# EasyEDA Pro project ProPrj_wildCat_2025-03-20.epro

# Schematic Schematic1
Board Name: Board1; Create Date: 2025-03-20; Page Name: P1; Project Name: wildCat; Schematic Name: Schematic1; Update Date: 2025-03-20; Company: 嘉立创EDA; Page Size: A4; Version: V1.0
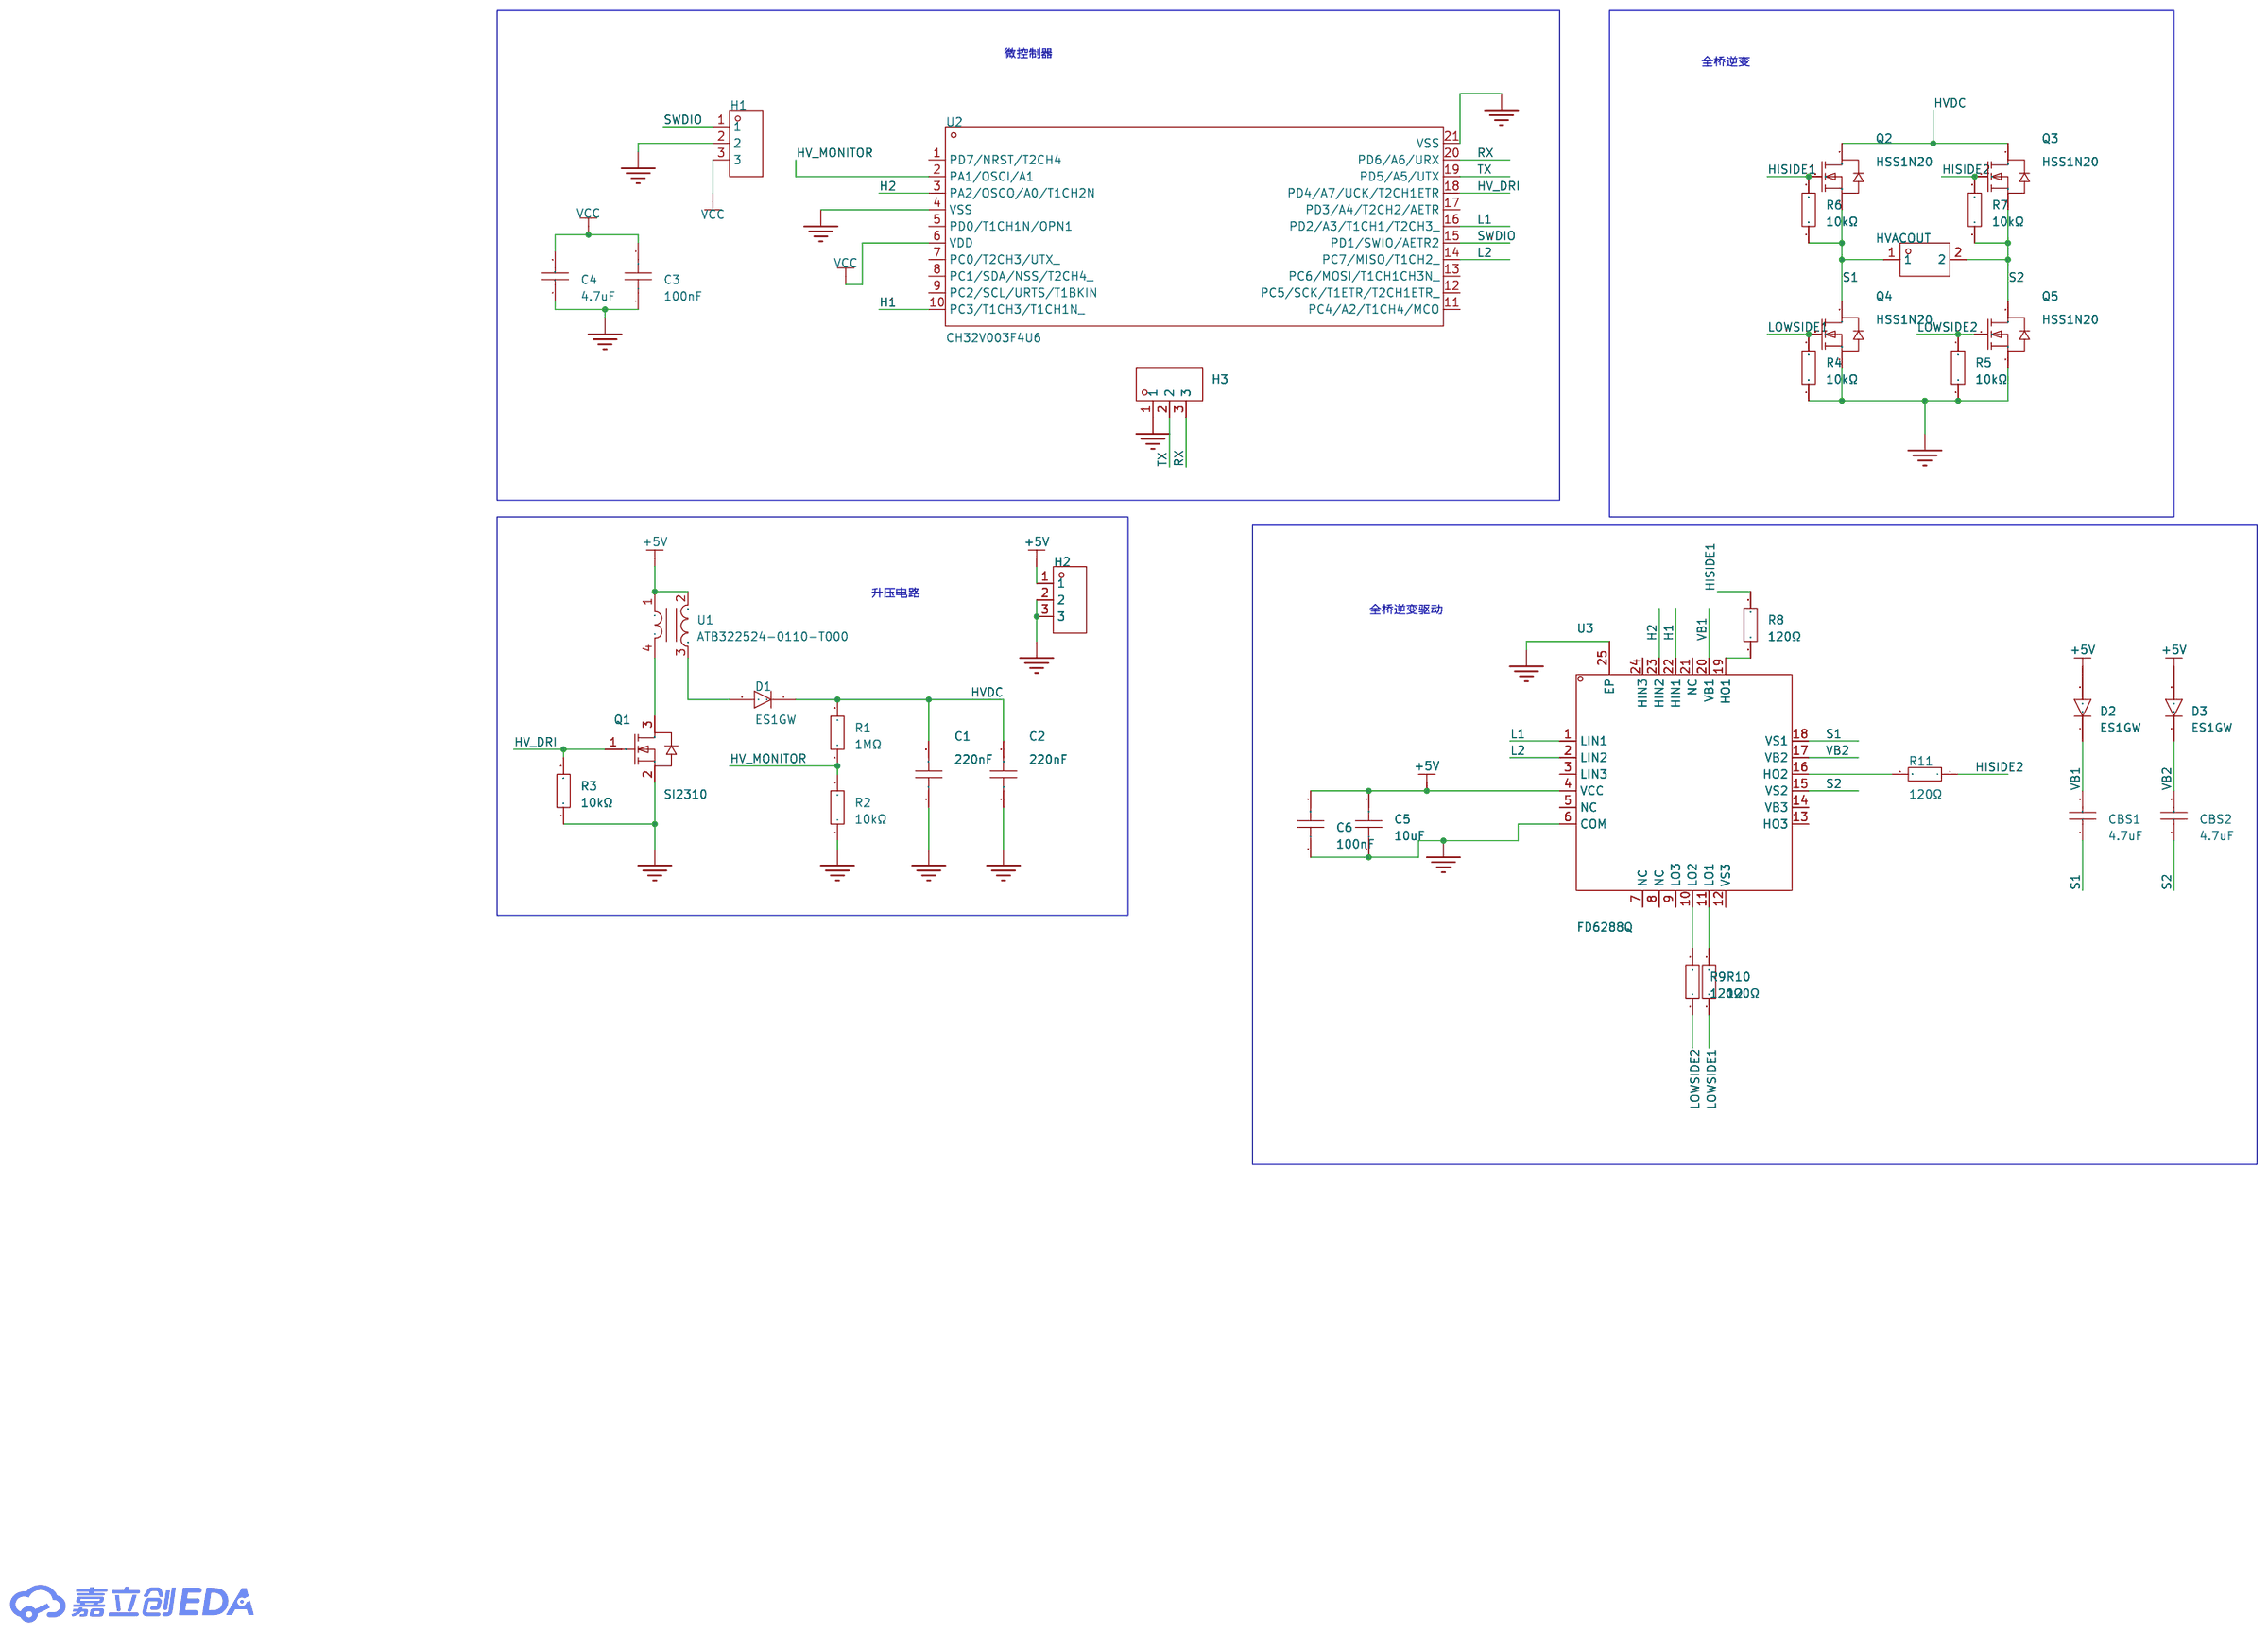
[diagram p0: schematic sheet]

## Parts
C1  220nF  [C1210]
C2  220nF  [C1210]
C3  100nF  [C0603]
C4  4.7uF  [C0805]
C5  10uF  [C1206]
C6  100nF  [C0603]
CBS1  4.7uF  [C0805]
CBS2  4.7uF  [C0805]
D1  ES1GW  [SOD-123FL_L2.7-W1.8-LS3.8-RD]
D2  ES1GW  [SOD-123FL_L2.7-W1.8-LS3.8-RD]
D3  ES1GW  [SOD-123FL_L2.7-W1.8-LS3.8-RD]
H1  -  [HDR-TH_3P-P2.54-V-F]
H2  -  [HDR-TH_3P-P2.54-V-F]
H3  -  [HDR-TH_3P-P2.54-V-F]
HVACOUT  -  [HDR-TH_2P-P2.54-V-M-2]
Q1  SI2310  [SOT-23_L2.9-W1.3-P1.90-LS2.4-BR]
Q2  HSS1N20  [SOT-23-3_L2.9-W1.6-P1.90-LS2.8-BR]
Q3  HSS1N20  [SOT-23-3_L2.9-W1.6-P1.90-LS2.8-BR]
Q4  HSS1N20  [SOT-23-3_L2.9-W1.6-P1.90-LS2.8-BR]
Q5  HSS1N20  [SOT-23-3_L2.9-W1.6-P1.90-LS2.8-BR]
R1  1MΩ  [R0603]
R2  10kΩ  [R0603]
R3  10kΩ  [R0603]
R4  10kΩ  [R0603]
R5  10kΩ  [R0603]
R6  10kΩ  [R0603]
R7  10kΩ  [R0603]
R8  120Ω  [R0603]
R9  120Ω  [R0603]
R10  120Ω  [R0603]
R11  120Ω  [R0603]
U1  ATB322524-0110-T000  [XFMR-SMD_ATB322515-0110-T000]
U2  CH32V003F4U6  [QFN-20_L3.0-W3.0-P0.40-TL-EP1.7]
U3  FD6288Q  [QFN-24_L4.0-W4.0-P0.50-BL-EP2.6]

## Library data of the parts
C1 C2 = CC1210KKX7RYBB224: 容值:220nF;精度:±10%;额定电压:250V;材质(温度系数):X7R;; LCSC Part Name: 220nF ±10% 250V; Supplier Part: C326671; Manufacturer: YAGEO(国巨); Supplier Footprint: 1210; JLCPCB Part Class: 扩展库; Datasheet: https://atta.szlcsc.com/upload/public/pdf/source/20181031/C326671_E05A76D6DA213ECA4F67921FD917BD9F.pdf; Supplier: LCSC; Tolerance: ±10%; Voltage Rated: 250V; Temperature Coefficient: X7R
C3 C6 = CGA0603X7R104K500JT: 容值:100nF;精度:±10%;额定电压:50V;温度系数:X7R;; LCSC Part Name: 100nF ±10% 50V; Supplier Part: C6119867; Manufacturer: HRE(芯声); Supplier Footprint: 0603; JLCPCB Part Class: 扩展库; Datasheet: https://atta.szlcsc.com/upload/public/pdf/source/20250103/C44077DA9E7B3EFAE02F22B6D3D1CBC9.pdf; Supplier: LCSC; Tolerance: ±10%; Voltage Rating: 50V; Temperature Coefficient: X7R
C4 CBS1 CBS2 = CL21A475KBQNNNE: 容值:4.7uF;精度:±10%;额定电压:50V;材质(温度系数):X5R;; LCSC Part Name: 4.7uF ±10% 50V; Supplier Part: C98192; Manufacturer: SAMSUNG(三星); Supplier Footprint: 0805; JLCPCB Part Class: 扩展库; Datasheet: https://atta.szlcsc.com/upload/public/pdf/source/20160218/1457707763339.pdf; Supplier: LCSC; Tolerance: ±10%; Voltage Rated: 50V; Temperature Coefficient: X5R
C5 = HGC1206R5106K500NSPJ: 容值:10uF;精度:±10%;额定电压:50V;温度系数:X5R;; LCSC Part Name: 10uF ±10% 50V; Supplier Part: C7432781; Manufacturer: Chinocera(华瓷); Supplier Footprint: 1206; JLCPCB Part Class: 扩展库; Datasheet: https://atta.szlcsc.com/upload/public/pdf/source/20240320/FAC3FEC40A78BC5CCCE96C232A94D860.pdf; Supplier: LCSC; Tolerance: ±10%; Voltage Rating: 50V; Temperature Coefficient: X5R
D1-D3 = ES1GW_C128697: 二极管配置:独立式;正向压降(Vf):1.25V@1A;直流反向耐压(Vr):400V;整流电流:1A;反向恢复时间(trr):35ns;; Supplier Part: C128697; Manufacturer: 晶导微电子; Supplier Footprint: SOD-123F; JLCPCB Part Class: 扩展库; Datasheet: https://atta.szlcsc.com/upload/public/pdf/source/20170918/C128697_1505700123436974922.pdf; Supplier: LCSC; Diode Configuration: 独立式; Forward Voltage (Vf@If): 1.25V@1A; Reverse Voltage (Vr): 400V; Rectified Current: 1A; Reverse Leakage Current (Ir): 5uA@400V; Reverse Recovery Time (trr): 35ns; Operating Temperature: -55℃~+150℃@(Tj)
H1-H3 = HDR-F_2.54_1x3P: Supplier Part: C541850; Supplier Footprint: 插件
HVACOUT = HDR-M_2.54_2x1: Supplier Part: C2883961; Supplier Footprint: 插件,P=2.54mm
Q1 = SI2310_C2938374: 类型:-;漏源电压(Vdss):60V;连续漏极电流(Id):3A;导通电阻(RDS(on)):125mΩ@4.5V,3A;耗散功率(Pd):1.5W;阈值电压(Vgs(th)):500mV;; LCSC Part Name: N沟道,电流:3A,耐压:60V; Supplier Part: C2938374; Manufacturer: GOODWORK(固得沃克); Supplier Footprint: SOT-23; JLCPCB Part Class: 扩展库; Datasheet: https://atta.szlcsc.com/upload/public/pdf/source/20240805/D069A40A104CC19EC37E6FD1F86C8B27.pdf; Supplier: LCSC; Drain to Source Voltage: 60V; Current - Continuous Drain(Id): 3A; RDS(on): 125mΩ@4.5V,3A; Pd - Power Dissipation: 1.5W; Gate Threshold Voltage (Vgs(th)@Id): 500mV; Gate Charge(Qg): 6nC@10V; Input Capacitance(Ciss@Vds): 247pF; Reverse Transfer Capacitance (Crss@Vds): 19.5pF; Operating Temperature: -55℃~+150℃
Q2-Q5 = HSS1N20: 类型:1个N沟道;漏源电压(Vdss):200V;连续漏极电流(Id):1A;导通电阻(RDS(on)):1.9Ω@10V,1A;耗散功率(Pd):710mW;阈值电压(Vgs(th)):2.5V;; LCSC Part Name: 1个N沟道 耐压:200V 电流:1A; Supplier Part: C845589; Manufacturer: HUASHUO(华朔); Supplier Footprint: SOT-23L; JLCPCB Part Class: 扩展库; Datasheet: https://atta.szlcsc.com/upload/public/pdf/source/20201013/C845589_D2D04504AFB971EFF5652784C1E024CF.pdf; Supplier: LCSC; Type: 1个N沟道; Drain to Source Voltage: 200V; Current - Continuous Drain(Id): 1A; RDS(on): 1.9Ω@10V,1A; Pd - Power Dissipation: 710mW; Gate Threshold Voltage (Vgs(th)@Id): 2.5V; Gate Charge(Qg): 12nC@10V; Input Capacitance(Ciss@Vds): 145pF@25V; Reverse Transfer Capacitance (Crss@Vds): 3pF@25V
R1 = 0603WAF1004T5E: 电阻类型:厚膜电阻;阻值:1MΩ;精度:±1%;功率:100mW;最大工作电压:75V;温度系数:±100ppm/℃;; LCSC Part Name: 1MΩ ±1% 100mW 厚膜电阻; Supplier Part: C22935; Manufacturer: UNI-ROYAL(厚声); Supplier Footprint: 0603; JLCPCB Part Class: 基础库; Datasheet: https://atta.szlcsc.com/upload/public/pdf/source/20200306/C422600_1E6D84923E4A46A82E41ADD87F860B5C.pdf; Supplier: LCSC; Type: 厚膜电阻; Tolerance: ±1%; Power(Watts): 100mW; Overload Voltage (Max): 75V; Temperature Coefficient: ±100ppm/℃; Operating Temperature Range: -55℃~+155℃
R2-R7 = 0603WAF1002T5E: 电阻类型:厚膜电阻;阻值:10kΩ;精度:±1%;功率:100mW;最大工作电压:75V;温度系数:±100ppm/℃;; LCSC Part Name: 厚膜电阻 10kΩ ±1% 100mW; Supplier Part: C25804; Manufacturer: UNI-ROYAL(厚声); Supplier Footprint: 0603; JLCPCB Part Class: Basic Part; Datasheet: https://atta.szlcsc.com/upload/public/pdf/source/20200306/C422600_1E6D84923E4A46A82E41ADD87F860B5C.pdf; Supplier: LCSC; Type: 厚膜电阻; Tolerance: ±1%; Power(Watts): 100mW; Overload Voltage (Max): 75V; Temperature Coefficient: ±100ppm/℃; Operating Temperature Range: -55℃~+155℃
R8-R11 = 0603WAF1200T5E: 电阻类型:厚膜电阻;阻值:120Ω;精度:±1%;功率:100mW;最大工作电压:75V;温度系数:±100ppm/℃;; LCSC Part Name: 120Ω ±1% 100mW 厚膜电阻; Supplier Part: C22787; Manufacturer: UNI-ROYAL(厚声); Supplier Footprint: 0603; JLCPCB Part Class: 基础库; Datasheet: https://atta.szlcsc.com/upload/public/pdf/source/20200306/C422600_1E6D84923E4A46A82E41ADD87F860B5C.pdf; Supplier: LCSC; Type: 厚膜电阻; Tolerance: ±1%; Power(Watts): 100mW; Overload Voltage (Max): 75V; Temperature Coefficient: ±100ppm/℃; Operating Temperature Range: -55℃~+155℃
U1 = ATB322524-0110-T000: 初级电压:-;次级电压:-;输出电流:-;功率:-;; LCSC Part Name: 升压变压器; Supplier Part: C249001; Manufacturer: TDK; Supplier Footprint: SMD; JLCPCB Part Class: 扩展库; Datasheet: https://atta.szlcsc.com/upload/public/pdf/source/20180719/C249001_45035A300399F2A41F111958812A8988.pdf; Supplier: LCSC
U2 = CH32V003F4U6: CPU内核:RISC-V;程序存储容量:16KB;RAM总容量:2KB;GPIO端口数量:18;工作电压范围:-;CPU最大主频:48MHz;程序存储器类型:-;应用领域:-;; Supplier Part: C5299908; Manufacturer: WCH(南京沁恒); Supplier Footprint: QFN-20(3X3); JLCPCB Part Class: 扩展库; Datasheet: https://atta.szlcsc.com/upload/public/pdf/source/20240313/77CE2EF5E2A3AF5A92256F1D84EF4244.pdf; Supplier: LCSC; CPU Core: RISC-V; Program Storage Size: 16KB; RAM Size: 2KB; GPIO Ports Number: 18; CPU Maximum Speed: 48MHz; UART/USART: 1; I2C: 1; SPI: 1; Watchdog: 有; Real-Time Clock: 有
U3 = FD6288Q: Supplier Part: C328453; Manufacturer: Fortior Tech(峰岹); Supplier Footprint: QFN-24-EP(4x4); JLCPCB Part Class: 扩展库; Datasheet: https://atta.szlcsc.com/upload/public/pdf/source/20241101/0E2856EB301EAFFED732065FB088D773.pdf; Supplier: LCSC

## Nets
+5V: C5.2 C6.2 D2.2(A) D3.2(A) H2.1 U1.1 U1.2 U3.4(VCC)
GND: C1.1 C2.1 C3.1 C4.1 C5.1 C6.1 H1.2 H2.2 H2.3 H3.1 Q1.2(S) Q4.2(S) Q5.2(S) R2.1 R3.1 R4.1 R5.1 U2.4(VSS) U2.21(VSS) U3.6(COM) U3.25(EP)
VCC: C3.2 C4.2 H1.3 U2.6(VDD)
H1: U2.10(PC3/T1CH3/T1CH1N_) U3.22(HIN1)
H2: U2.3(PA2/OSCO/A0/T1CH2N) U3.23(HIN2)
HISIDE1: Q2.1(G) R6.2 R8.2
HISIDE2: Q3.1(G) R7.2 R11.1
HV_DRI: Q1.1(G) R3.2 U2.18(PD4/A7/UCK/T2CH1ETR)
HV_MONITOR: R1.1 R2.2 U2.2(PA1/OSCI/A1)
HVDC: C1.2 C2.2 D1.1(C) Q2.3(D) Q3.3(D) R1.2
L1: U2.16(PD2/A3/T1CH1/T2CH3_) U3.1(LIN1)
L2: U2.14(PC7/MISO/T1CH2_) U3.2(LIN2)
LOWSIDE1: Q4.1(G) R4.2 R10.1
LOWSIDE2: Q5.1(G) R5.2 R9.1
RX: H3.3 U2.20(PD6/A6/URX)
S1: CBS1.1 HVACOUT.1 Q2.2(S) Q4.3(D) R6.1 U3.18(VS1)
S2: CBS2.1 HVACOUT.2 Q3.2(S) Q5.3(D) R7.1 U3.15(VS2)
SWDIO: H1.1 U2.15(PD1/SWIO/AETR2)
TX: H3.2 U2.19(PD5/A5/UTX)
VB1: CBS1.2 D2.1(C) U3.20(VB1)
VB2: CBS2.2 D3.1(C) U3.17(VB2)
$1N293: Q1.3(D) U1.4
$1N442: D1.2(A) U1.3
$1N2320: R11.2 U3.16(HO2)
$1N2486: R8.1 U3.19(HO1)
$1N2533: R9.2 U3.10(LO2)
$1N2576: R10.2 U3.11(LO1)

Not connected (* = marked no-connect by the designer): U2 1(PD7/NRST/T2CH4) 5(PD0/T1CH1N/OPN1) 7(PC0/T2CH3/UTX_) 8(PC1/SDA/NSS/T2CH4_) 9(PC2/SCL/URTS/T1BKIN) 11(PC4/A2/T1CH4/MCO) 12(PC5/SCK/T1ETR/T2CH1ETR_) 13(PC6/MOSI/T1CH1CH3N_) 17(PD3/A4/T2CH2/AETR); U3 3(LIN3) 5(NC) 7(NC) 8(NC) 9(LO3) 12(VS3) 13(HO3) 14(VB3) 21(NC) 24(HIN3)

## Notes on the sheet
- 微控制器
- 全桥逆变
- 升压电路
- 全桥逆变驱动

# Board PCB1
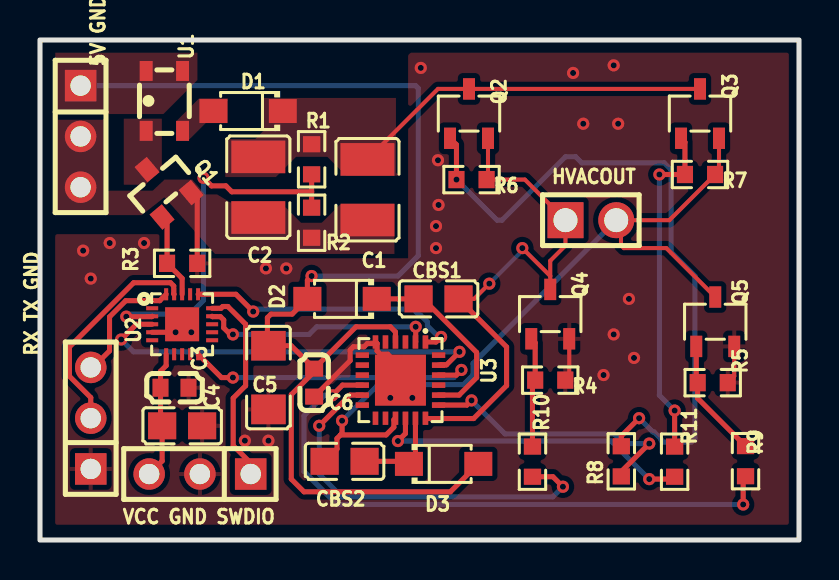
[diagram p1: board, top side]
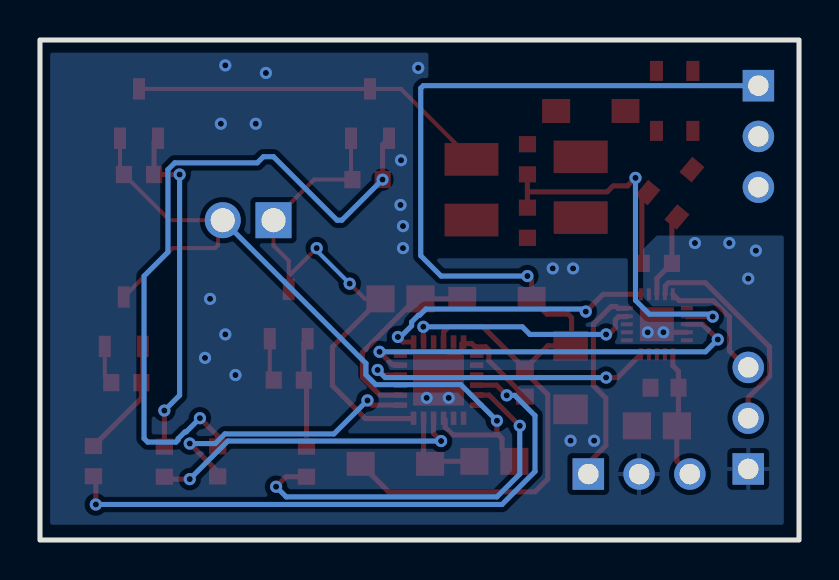
[diagram p2: board, bottom side, seen from below]

Outline 37.97 x 25.02 mm; copper layers: Top Layer, Bottom Layer. Coordinates in mm from the lower left corner of the outline.
Outline path: rectangle 0,25.02 37.97,0
Stack: Top Layer 0.035mm / Dielectric1 1.51mm FR4 er 4.5 / Bottom Layer 0.035mm

## Design rules (mm)
template: JLCPCB Capability(Two Layers Board)
spacing copperThickness1oz (default): track to track 0.102, other pairs 0.152 to 0.3
spacing copperThickness2oz: track to track 0.203, other pairs 0.152 to 0.3
track width copperThickness1oz (default): min 0.127, default 0.254, max 2.54
track width copperThickness2oz: min 0.203, default 0.254, max 2.54
differential pair differentialPair (default): width min 0.127, default 0.254, max 2.54; gap min 0.152, default 0.152
via viaSize (default): diameter min 0.5, default 0.61, max 10; hole min 0.3, default 0.305, max 6.3

## Placement (name value [footprint] x y rotation side)
5V GND GND  -  [HDR-TH_3P-P2.54-V-F]  2.03 20.19 270 top
C1  220nF  [C1210]  16.38 17.53 90 top
C2  220nF  [C1210]  10.92 17.65 90 top
C3  100nF  [C0603]  6.73 7.62 180 top
C4  4.7uF  [C0805]  7.11 5.72 180 top
C5  10uF  [C1206]  11.43 8.13 90 top
C6  100nF  [C0603]  13.72 7.87 90 top
CBS1  4.7uF  [C0805]  19.94 12.06 180 top
CBS2  4.7uF  [C0805]  15.24 3.94 0 top
D1  ES1GW  [SOD-123FL_L2.7-W1.8-LS3.8-RD]  10.41 21.46 180 top
D2  ES1GW  [SOD-123FL_L2.7-W1.8-LS3.8-RD]  15.11 12.06 180 top
D3  ES1GW  [SOD-123FL_L2.7-W1.8-LS3.8-RD]  20.19 3.81 0 top
HVACOUT  -  [HDR-TH_2P-P2.54-V-M-2]  27.56 16 270 top
Q1  SI2310  [SOT-23_L2.9-W1.3-P1.90-LS2.4-BR]  6.1 17.65 310 top
Q2  HSS1N20  [SOT-23-3_L2.9-W1.6-P1.90-LS2.8-BR]  21.46 21.34 270 top
Q3  HSS1N20  [SOT-23-3_L2.9-W1.6-P1.90-LS2.8-BR]  33.02 21.34 270 top
Q4  HSS1N20  [SOT-23-3_L2.9-W1.6-P1.90-LS2.8-BR]  25.53 11.3 270 top
Q5  HSS1N20  [SOT-23-3_L2.9-W1.6-P1.90-LS2.8-BR]  33.78 10.92 270 top
R1  1MΩ  [R0603]  13.59 19.05 90 top
R2  10kΩ  [R0603]  13.59 15.88 90 top
R3  10kΩ  [R0603]  7.11 13.84 180 top
R4  10kΩ  [R0603]  25.53 8 180 top
R5  10kΩ  [R0603]  33.66 7.87 180 top
R6  10kΩ  [R0603]  21.59 18.03 180 top
R7  10kΩ  [R0603]  33.02 18.29 180 top
R8  120Ω  [R0603]  29.08 3.94 90 top
R9  120Ω  [R0603]  35.3 3.95 270 top
R10  120Ω  [R0603]  24.64 3.92 270 top
R11  120Ω  [R0603]  31.75 3.92 270 top
RX TX GND  -  [HDR-TH_3P-P2.54-V-F]  2.54 6.1 90 top
U1  ATB322524-0110-T000  [XFMR-SMD_ATB322515-0110-T000]  6.22 21.97 270 top
U2  CH32V003F4U6  [QFN-20_L3.0-W3.0-P0.40-TL-EP1.7]  7.11 10.8 0 top
U3  FD6288Q  [QFN-24_L4.0-W4.0-P0.50-BL-EP2.6]  18.03 8 180 top
VCC GND SWDIO  -  [HDR-TH_3P-P2.54-V-F]  8 3.3 180 top

## Footprints (pads in the part's own frame, mm; a bottom-side part is the same pattern mirrored in y, then rotated)
C0603
  rect 0.8x0.9 smd: 1(-0.7,0) 2(0.7,0)
C0805
  rect 1.41x1.35 smd: 1(-1,0) 2(1,0)
C1206
  rect 1.485x1.728 smd: 1(-1.593,0) 2(1.593,0)
C1210
  rect 1.635x2.7 smd: 1(-1.518,0) 2(1.518,0)
HDR-TH_2P-P2.54-V-M-2
  rect 1.8x1.8 hole 1.2: 1(0,-1.27)
  round 1.8 hole 1.2: 2(0,1.27)
HDR-TH_3P-P2.54-V-F
  rect 1.575x1.575 hole 1.02: 1(-2.54,0)
  round 1.575 hole 1.02: 2(0,0) 3(2.54,0)
QFN-20_L3.0-W3.0-P0.40-TL-EP1.7
  rect 0.6x0.2 smd: 1(-1.5,0.8) 2(-1.5,0.401) 3(-1.5,0) 4(-1.5,-0.4) 5(-1.5,-0.8) 11(1.5,-0.8) 12(1.5,-0.4) 13(1.5,0) 14(1.5,0.401) 15(1.5,0.8)
  rect 0.2x0.6 smd: 6(-0.8,-1.5) 7(-0.4,-1.5) 8(0,-1.5) 9(0.4,-1.5) 10(0.799,-1.5) 16(0.8,1.5) 17(0.4,1.5) 18(0,1.5) 19(-0.4,1.5) 20(-0.8,1.5)
  rect 1.7x1.7 smd: 21(0,0)
QFN-24_L4.0-W4.0-P0.50-BL-EP2.6
  rect 0.28x0.665 smd: 1(-1.25,-1.907) 2(-0.75,-1.907) 3(-0.25,-1.907) 4(0.25,-1.907) 5(0.75,-1.907) 6(1.25,-1.907) 13(1.25,1.907) 14(0.75,1.907) 15(0.25,1.907) 16(-0.25,1.907) 17(-0.75,1.907) 18(-1.25,1.907)
  rect 0.665x0.28 smd: 7(1.907,-1.25) 8(1.907,-0.75) 9(1.907,-0.25) 10(1.907,0.25) 11(1.907,0.75) 12(1.907,1.25) 19(-1.907,1.25) 20(-1.907,0.75) 21(-1.907,0.25) 22(-1.907,-0.25) 23(-1.907,-0.75) 24(-1.907,-1.25)
  rect 2.55x2.55 smd: 25(0,0)
R0603
  rect 0.806x0.864 smd: 1(-0.753,0) 2(0.753,0)
SOD-123FL_L2.7-W1.8-LS3.8-RD
  rect 1.4x1.2 smd: 1(-1.735,0) 2(1.735,0)
SOT-23-3_L2.9-W1.6-P1.90-LS2.8-BR
  rect 1.07x0.6 smd: 1(1.235,-0.95) 2(1.235,0.95) 3(-1.235,0)
SOT-23_L2.9-W1.3-P1.90-LS2.4-BR
  rect 1x0.8 smd: 1(1.15,-0.95) 2(1.15,0.95) 3(-1.15,0)
XFMR-SMD_ATB322515-0110-T000
  rect 1x0.65 smd: 1(-1.5,-0.91) 2(-1.5,0.91) 3(1.5,0.91) 4(1.5,-0.91)

## Nets
+5V: 5V GND GND.1 C5.2 C6.2 D2.2 D3.2 U1.1 U1.2 U3.4
GND: 5V GND GND.2 5V GND GND.3 C1.1 C2.1 C3.1 C4.1 C5.1 C6.1 Q1.2 Q4.2 Q5.2 R2.1 R3.1 R4.1 R5.1 RX TX GND.1 U2.4 U2.21 U3.6 U3.25 VCC GND SWDIO.2
VCC: C3.2 C4.2 U2.6 VCC GND SWDIO.3
H1: U2.10 U3.22
H2: U2.3 U3.23
HISIDE1: Q2.1 R6.2 R8.2
HISIDE2: Q3.1 R7.2 R11.1
HV_DRI: Q1.1 R3.2 U2.18
HV_MONITOR: R1.1 R2.2 U2.2
HVDC: C1.2 C2.2 D1.1 Q2.3 Q3.3 R1.2
L1: U2.16 U3.1
L2: U2.14 U3.2
LOWSIDE1: Q4.1 R4.2 R10.1
LOWSIDE2: Q5.1 R5.2 R9.1
RX: RX TX GND.3 U2.20
S1: CBS1.1 HVACOUT.1 Q2.2 Q4.3 R6.1 U3.18
S2: CBS2.1 HVACOUT.2 Q3.2 Q5.3 R7.1 U3.15
SWDIO: U2.15 VCC GND SWDIO.1
TX: RX TX GND.2 U2.19
VB1: CBS1.2 D2.1 U3.20
VB2: CBS2.2 D3.1 U3.17
$1N293: Q1.3 U1.4
$1N442: D1.2 U1.3
$1N2320: R11.2 U3.16
$1N2486: R8.1 U3.19
$1N2533: R9.2 U3.10
$1N2576: R10.2 U3.11

Pads without a net: U2 1 5 7 8 9 11 12 13 17; U3 3 5 7 8 9 12 13 14 21 24

## Via types
v1: diameter 0.61, hole 0.305, Top Layer to Bottom Layer, 51 vias

## Routing (per net, layer and track width the routed paths; a pad name or vN(x,y) marks a point on that pad's centre or on a via; arc(x,y) is an arc through that point)
+5V: length 60.6
  Top Layer w0.254: C6.2 12.57,9.72 C5.2 11.38,9.77 11.38,11.12 11.56,11.3 12.62,11.3 D2.2 13.38,13 v1(13.59,13.21) ; C6.2 13.72,8.42 12.57,7.28 12.57,3.05 13.21,2.41 20.53,2.41 D3.2 ; C6.2 15.81,10.67 17.53,10.67 17.78,10.41 U3.4
  Bottom Layer w0.254: 5V GND GND.1 18.8,22.73 18.92,22.61 18.92,14.22 17.91,13.21 v1(13.59,13.21)
GND: length 16.7
  Top Layer w0.203: R4.1 26.48,8.2 26.48,10.07 ; R5.1 34.73,8.2 Q5.2
  Top Layer w0.254: 16.86,9.83 16.86,9.46 17.03,9.3 17.4,9.3 18.03,8.66 U3.25 ; 16.86,9.83 U3.6 ; 16.86,9.83 16.37,9.83 16.21,9.67 15.68,9.67 15.51,9.51 15.51,8.97 C6.1 ; R3.1 7.87,17.08 Q1.2 ; U2.4 v1(6.78,10.39) 7.11,10.72 U2.21
  vias: v1(2.16,14.48) v1(2.54,13.08) v1(3.49,14.86) v1(5.21,14.86) v1(7.57,10.39) v1(10.25,4.97) v1(11.3,13.59) v1(11.43,4.97) v1(12.32,13.59) v1(17.53,7.11) v1(18.63,7.11) v1(19.05,23.62) v1(19.81,15.71) v1(19.81,14.61) v1(19.91,19) v1(19.94,16.76) v1(26.67,23.37) v1(27.18,20.83) v1(28.19,8.25) v1(28.7,23.75) v1(28.7,10.29) v1(28.92,20.83) v1(29.46,12.06) v1(29.72,9.11)
VCC: length 6.4
  Top Layer w0.254: U2.6 6.31,8.72 6.03,8.44 C3.2 6.03,5.8 C4.2 6.11,3.95 VCC GND SWDIO.3
H1: length 15.1
  Top Layer w0.254: U2.10 9.08,8.13 v1(9.65,8.13) ; v1(21.08,8.51) 20.82,8.25 U3.22
  Bottom Layer w0.254: v1(9.65,8.13) 20.7,8.13 v1(21.08,8.51)
H2: length 20.4
  Top Layer w0.254: v1(4.06,10.03) 4.83,10.8 U2.3 ; U3.23 20.05,8.75 20.07,8.76 20.33,8.76 v1(20.99,9.42)
  Bottom Layer w0.254: v1(4.06,10.03) 4.68,9.42 v1(20.99,9.42)
HISIDE1: length 34.5
  Top Layer w0.254: v1(29.97,6.1) 29.08,5.21 R8.2 ; v1(20.84,18.03) 20.84,19.78 Q2.1
  Bottom Layer w0.254: v1(20.84,18.03) 22.87,16 23.11,16 26.29,19.18 26.8,19.18 27.1,18.87 31.23,18.87 31.57,18.53 31.57,14.4 32.77,13.21 32.77,5.08 32.59,4.9 31.17,4.9 31.06,5 31.06,5.07 30.72,5.41 30.66,5.41 v1(29.97,6.1)
HISIDE2: length 17.1
  Top Layer w0.254: v1(31.75,6.48) R11.1 ; Q3.1 32.27,19.9 R7.2 v1(30.99,18.29)
  Bottom Layer w0.254: v1(31.75,6.48) 30.99,7.24 v1(30.99,18.29)
HV_DRI: length 4.3
  Top Layer w0.254: U2.18 7.11,13.09 R3.2 6.36,15.91 Q1.1
HV_MONITOR: length 19
  Top Layer w0.254: v1(8.18,18.12) 8.58,17.72 9.3,17.72 9.6,17.42 13.58,17.42 13.59,17.43 ; R1.1 13.59,17.43 ; 13.59,17.43 R2.2 ; v1(4.32,11.18) 5.59,11.18 U2.2
  Bottom Layer w0.254: v1(8.18,18.12) 8.18,11.99 7.49,11.3 4.44,11.3 v1(4.32,11.18)
HVDC: length 18.1
  Top Layer w0.203: Q3.3 Q2.3 19.91,22.57 C1.2
L1: length 14.1
  Top Layer w0.254: U2.16 9.8,12.3 v1(10.67,11.43) ; U3.1 19.81,9.91 v1(20.07,10.16)
  Bottom Layer w0.254: v1(10.67,11.43) 10.79,11.56 18.67,11.56 18.97,11.25 19.04,11.25 19.38,10.91 19.38,10.72 19.94,10.16 v1(20.07,10.16)
L2: length 11.7
  Top Layer w0.254: v1(18.8,10.67) 18.8,9.92 U3.2 ; U2.14 8.63,11.17 9.03,11.17 9.19,11.01 9.19,10.62 9.52,10.29 v1(9.65,10.29)
  Bottom Layer w0.254: v1(18.8,10.67) 13.84,10.67 13.46,10.29 v1(9.65,10.29)
LOWSIDE1: length 5.5
  Top Layer w0.254: R10.1 24.64,7.87 R4.2 24.77,9.87 Q4.1
LOWSIDE2: length 6
  Top Layer w0.254: Q5.1 32.83,7.94 R5.2 32.9,7.09 R9.1
RX: length 6.3
  Top Layer w0.254: U2.20 5.99,11.97 4.29,11.97 3.48,11.16 3.48,9.46 2.65,8.64 RX TX GND.3
S1: length 27
  Top Layer w0.203: Q2.2 22.41,18.1 R6.1 24.26,18.03 HVACOUT.1 26.29,14.73 25.53,13.97 25.53,13.21 ; v1(22.48,12.83) 21.72,12.06 CBS1.1 ; v1(24.13,14.61) 25.53,13.21 ; 25.53,13.21 Q4.3
  Top Layer w0.254: CBS1.1 23.34,9.66 23.34,7.73 21.69,6.08 19.3,6.08 U3.18
  Bottom Layer w0.203: v1(24.13,14.61) 24.13,14.48 v1(22.48,12.83)
S2: length 38.8
  Top Layer w0.203: Q5.3 31.33,14.61 29.21,14.61 29.07,14.75 29.07,15.76 HVACOUT.2 31.49,16 R7.1 33.97,18.48 Q3.2
  Top Layer w0.254: CBS2.1 14.86,4.56 14.86,5.08 15.04,5.26 ; 15.04,5.26 15.11,5.33 v1(15.11,5.97) ; 15.04,5.26 17.32,5.26 17.7,5.65 17.7,6.01 U3.15
  Bottom Layer w0.254: v1(15.11,5.97) 16.92,7.77 21.17,7.77 21.67,8.27 21.67,8.84 HVACOUT.2
SWDIO: length 10.2
  Top Layer w0.254: U2.15 9.06,11.6 9.14,11.68 9.4,11.68 10.29,10.8 10.29,7.72 9.67,7.1 9.67,4.73 10.54,3.85 VCC GND SWDIO.1
TX: length 11
  Top Layer w0.254: U2.19 6.69,12.32 6.69,12.71 6.53,12.87 4.69,12.87 1.47,9.66 1.47,8.19 2.54,7.13 RX TX GND.2
VB1: length 9.6
  Top Layer w0.254: U3.20 20.97,7.25 21.84,8.13 21.84,9.39 19.16,12.06 CBS1.2 D2.1
VB2: length 4.7
  Top Layer w0.254: U3.17 18.78,4.14 D3.1 18.33,3.94 CBS2.2
$1N2320: length 16
  Top Layer w0.254: 31.75,3.17 31.63,3.05 v1(30.48,3.05) ; v1(17.91,4.95) 18.28,5.33 U3.16
  Bottom Layer w0.254: v1(30.48,3.05) 28.57,4.95 v1(17.91,4.95)
$1N2486: length 13.8
  Top Layer w0.254: R8.1 29.08,3.43 v1(30.48,4.83) ; U3.19 21.36,6.75 v1(21.59,6.98)
  Bottom Layer w0.254: v1(21.59,6.98) 23.27,5.31 28.72,5.31 29.21,4.83 v1(30.48,4.83)
$1N2533: length 30.5
  Top Layer w0.254: R9.2 35.18,3.07 v1(35.18,1.78) ; v1(14.62,7.24) 15.13,7.75 U3.10
  Bottom Layer w0.254: v1(14.62,7.24) 14.22,7.24 13.21,6.22 13.21,3.43 14.86,1.78 v1(35.18,1.78)
$1N2576: length 19.8
  Top Layer w0.254: v1(13.97,5.72) 15.51,7.25 U3.11 ; 24.64,3.17 25.66,3.17 v1(26.16,2.67)
  Bottom Layer w0.254: v1(13.97,5.72) 13.97,3.3 15.11,2.16 25.65,2.16 v1(26.16,2.67)

## Copper pours and planes (outline as drawn; the poured copper is in the pictures)
+5V on Top Layer: 0.76,24.38 7.87,24.38 7.87,21.31 0.76,21.31
GND on Top Layer: 0.76,21.02 17.73,21.02 17.73,14.32 0.76,14.32
GND on Top Layer: 0.76,15.3 7.04,15.3 8.24,14.1 18.41,14.1 18.41,24.26 18.54,24.38 37.47,24.38 37.47,0.76 0.76,0.76
GND on Bottom Layer: 0.76,15.24 7.11,15.24 8.25,14.1 18.54,14.1 18.54,24.38 37.47,24.38 37.47,0.76 0.76,0.76
HVDC on Top Layer: 9.27,22.12 17.96,22.12 17.96,18.16 9.27,18.16
$1N293 on Top Layer: 4.19,21.08 6.1,21.08 6.1,17.78 4.19,17.78
$1N442 on Top Layer: 6.86,22.1 9.4,22.1 9.4,20.07 6.86,20.07
